# Altium project Doppler_Radar_Speed_Detector.PrjPcb
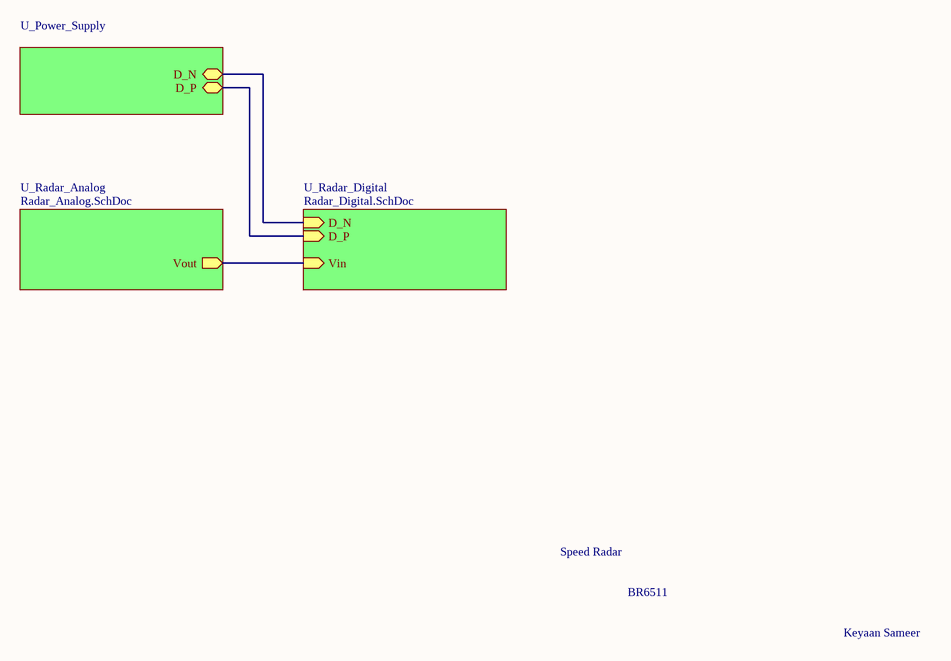
[diagram p0: SpeedRadarSchematic.SchDoc]
3 sheets, 31 parts. Net scope: hierarchical (ports join the sheet entries above them; power ports are global).
Board file: RADARPCB.PcbDoc
Sheets:
  SpeedRadarSchematic.SchDoc
    U_Radar_Digital = Radar_Digital.SchDoc
    U_Radar_Analog = Radar_Analog.SchDoc

## Sheet SpeedRadarSchematic.SchDoc
size A; SheetNumber: 1; SheetTotal: 4

### Sub-sheets
U_Power_Supply = Power_Supply.SchDoc (file not in this document): D_N (bidir), D_P (bidir)
U_Radar_Analog = Radar_Analog.SchDoc: Vout (out)
U_Radar_Digital = Radar_Digital.SchDoc: D_N (in), D_P (in), Vin (in)

### Nets
NetU1_13: sheet U_Radar_Digital/Vin, sheet U_Radar_Analog/Vout
NetU3_13: sheet U_Power_Supply/D_N, sheet U_Radar_Digital/D_N
NetU3_14: sheet U_Power_Supply/D_P, sheet U_Radar_Digital/D_P

### Notes on the sheet
- Speed Radar
- BR6511
- Keyaan Sameer

## Sheet Radar_Digital.SchDoc
size A; SheetNumber: 3; SheetTotal: 4
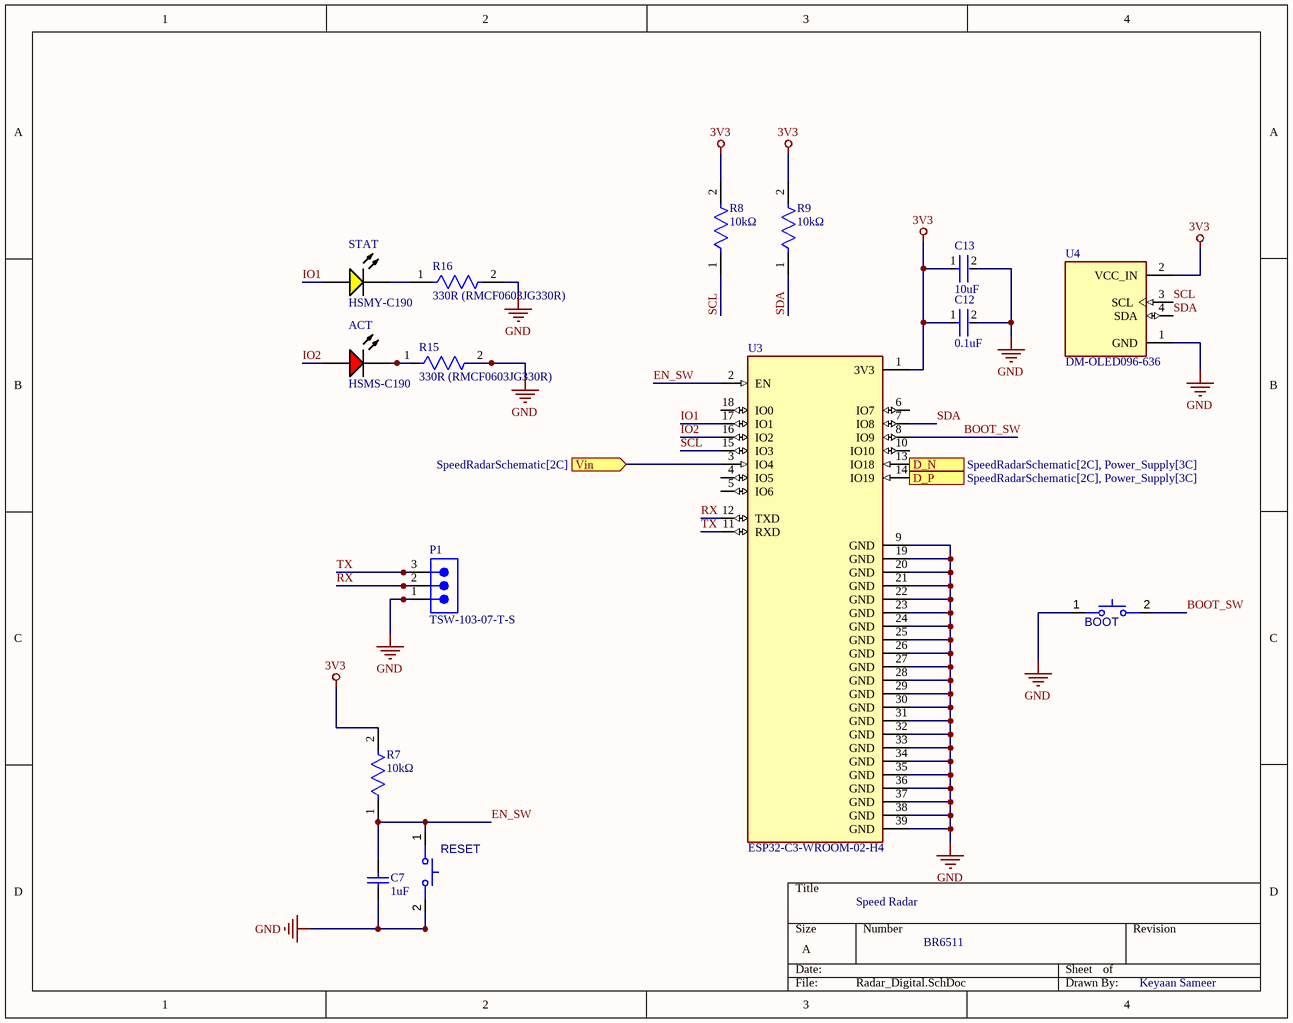
[diagram p1: Radar_Digital.SchDoc]

### Parts
ACT  HSMS-C190  [AVAG-HSMX-C190_V]
BOOT  B3U-1000P-B  [OMRON-B3U-1000P-2-B_V]  (value not drawn)
C7  1uF  [CAPC1608X90X35NL15T15]
C12  value 0.1uF  [FP-GCD21B-0_15-IPC_A]  (hidden comment: GCD21BR71H104KA01L)
C13  10uF  [FP-C0805C106K8RACAUTO-MFG]
P1  TSW-103-07-T-S  [SMTC-TSW-103-07-X-S]
R7  10kΩ  [FP-RQ732B-IPC_C]
R8  10kΩ  [FP-RQ732B-IPC_C]
R9  10kΩ  [FP-RQ732B-IPC_C]
R15  330R (RMCF0603JG330R)  [FP-RMCF0603-IPC_B]
R16  330R (RMCF0603JG330R)  [FP-RMCF0603-IPC_B]
RESET  B3U-1000P-B  [OMRON-B3U-1000P-2-B_V]  (value not drawn)
STAT  HSMY-C190  [AVAG-HSMX-C190_V]
U3  ESP32-C3-WROOM-02-H4  [MODULE_ESP32-C3-WROOM-02-H4]
U4  DM-OLED096-636  [MODULE_DM-OLED096-636]

### Ports
D_N (in, see SpeedRadarSchematic[2C], Power_Supply[3C]), D_P (in, see SpeedRadarSchematic[2C], Power_Supply[3C]), Vin (in, see SpeedRadarSchematic[2C])

### Nets
3V3: C12.1 C13.1 R7.2 R8.2 R9.2 U3.1(3V3) U4.2(VCC_IN)
GND: BOOT.1 C7.1 C12.2 C13.2 P1.1 R15.2 R16.2 RESET.2 U3.9(GND) U3.19(GND) U3.20(GND) U3.21(GND) U3.22(GND) U3.23(GND) U3.24(GND) U3.25(GND) U3.26(GND) U3.27(GND) U3.28(GND) U3.29(GND) U3.30(GND) U3.31(GND) U3.32(GND) U3.33(GND) U3.34(GND) U3.35(GND) U3.36(GND) U3.37(GND) U3.38(GND) U3.39(GND) U4.1(GND)
BOOT_SW: BOOT.2 U3.8(IO9)
EN_SW: C7.2 R7.1 RESET.1 U3.2(EN)
IO1: STAT.1(A) U3.17(IO1)
IO2: ACT.1(A) U3.16(IO2)
RX: P1.2 U3.12(TXD)
SCL: R8.1 U3.15(IO3) U4.3(SCL)
SDA: R9.1 U3.7(IO8) U4.4(SDA)
TX: P1.3 U3.11(RXD)
NetACT_2: ACT.2(K) R15.1
NetR16_1: R16.1 STAT.2(K)
NetU1_13: U3.3(IO4) ; port Vin
NetU3_13: U3.13(IO18) ; port D_N
NetU3_14: U3.14(IO19) ; port D_P

Not connected (* = marked no-connect by the designer): U3 4(IO5) 5(IO6) 6(IO7) 10(IO10) 18(IO0)

### Notes on the sheet
- Speed Radar
- BR6511
- Keyaan Sameer

### Library data of the parts
ACT = CMP-2000-06427-1: LED Uni-Color Red, 52 mW, 20 mA, -40 to 85 degC, 2-Pin SMD, RoHS, Tape and Reel; Manufacturer: Avago; Reverse Voltage: 5V; Viewing Angle: 170deg; High Brightness: No; Lens Type: ColorlessDiffused; DELETED: Compliant; Product Height (mm): 0.8mm; Dominant Wave Length: 626nm; Number of  Elements: 1; Chip Material: GaP; Lum Intensity: 10mcd; Product Length (mm): 1.6mm; Forward Voltage: 2.6V; Power Dissipation: 52W; Shape Type: Rectangular; Forward Current: 25mA; Peak Wavelength: 630nm; Test Current (It): 20mA; Main Category: ChipLED; Lens Dimensions: 1x0.8x0.5mm; Pin Count: 2; Package Reference: HSMX-C190; Mounting Technology: SurfaceMount; Mounting: SurfaceMount; Datasheet URL: http://docs.avagotech.com/docs/AV02-0551EN; Package Type: ChipLed; Operating Temperature Classification: Industrial; Datasheet Version: 03/2012; Operating Temp Range: -40Cto85C; Emitting Color: Red; Rad Hardened: No; Manufacturer URL: http://www.avagotech.com/; Luminous Intensity: 10mcd; Package Description: 2-Pin Surface Mount Device, Body 1.6 x 0.8 mm, Height 0.9 mm; Type: Uni-Color; Packaging: TapeandReel; Product Depth (mm): 0.8mm
BOOT RESET = CMP-011-00011-3: Ultra-small Surface-mounting Tactile Switches with High Contact Reliability, SPST-NO, -25 to 70 degC, 2-Pin SMD, RoHS, Tape and Reel; Voltage Rating: 12V; Current Rating: 50mA; Pins: 2; RoHS Compliant: Details
C7 = CMP-2006-04534-1: Part Number: 0603YD105MAT2A; Manufacturer: AVX Interconnect / Elco
C12 = CMP-001-00087-1: Ceramic Capacitor, Multilayer, Ceramic, 50V, 10% +Tol, 10% -Tol, X7R, 15% TC, 0.1uF, Surface Mount, 0805; Case/Package: 0805; Mounting Technology: Surface Mount; Min Operating Temperature: -55°C; Capacitor Type: Ceramic; Pins: 2; RoHS Compliant: Yes; Max Operating Temperature: 125°C
C13 = CMP-03020-034662-1: CAP CER 10UF 10V X7R 0805; Tolerance: 10%; Case/Package: 0805; Ratings: AEC-Q200; Packaging: Tape and Reel; Voltage Rating: 10V; Max Operating Temperature: 125°C; Min Operating Temperature: -55°C; Case Code (Metric): 2012; Case Code (Imperial): 0805; Mount: Surface Mount; RoHS Compliant: Yes; Capacitance: 10uF
P1 = CMP-1024-00332-1: 0.025" SQ Post Header, Through-hole, Vertical, -55 to 105 degC, 2.54 mm Pitch, 3-Pin, Male, RoHS; Manufacturer: Samtec; Pitch: 2.54 mm; ComponentLink1URL: http://www.samtec.com; ComponentLink3URL: http://www.samtec.com/documents/webfiles/cpdf/TSW-XXX-XX-XXX-X-XX-XXX-MKT.pdf; PartNumber: TSW-103-07-T-S; Mounting Technology: Through-hole; RoHS: True; DatasheetVersion: F-214; PackageVersion: DM, 8/1988; Temperature Range: -55 to 105 degC; ComponentLink2Description: Datasheet; ComponentLink1Description: Manufacturer URL; Orientation: Vertical; PackageReference: TSW-103-07-X-S; ComponentLink3Description: Package Specification; ComponentLink2URL: http://www.samtec.com/documents/webfiles/pdf/TSW_TH.PDF; PackageDescription: .025[0.64] SQ. Post Terminal Strip Assembly
R7-R9 = CMP-03211-005393-1: RQ732B 1206 10KΩ 0.4W 10ppm/°C 0.1% 200V; Manufacturer: TE; Manufacturer Part Number: RQ73C2B10KBTD; Automotive Grade: Grade 0; ComponentLink2URL: https://www.te.com/commerce/DocumentDelivery/DDEController?Action=showdoc&DocId=Data+Sheet%7F1773270-2%7FA%7Fpdf%7FEnglish%7FENG_DS_1773270-2_A.pdf%7F9-2176388-464; Temperature Range Low: -55°C; Power Rating: 0.4W; Voltage Rating: 200V; RoHS: TRUE; ComponentLink2Description: Datasheet; Composition: Thin Film; Temperature Coefficient: 10ppm/°C; Height: 0.75mm; Ipc Land Pattern Name: RESC310160X60; Series: RQ73; Temperature: -55°C to +155°C; Package: RQ732B; Automotive: Yes; Category: Res; Octopart: https://octopart.com/rq73c2b10kbtd-te+connectivity-93910771; Resistance: 10KΩ; Lead Free: Yes; Temperature Range High: +155°C; Device Class L3: Chip SMD Resistors; Tolerance: 0.1%; Device Class L1: Passive Components; Value: 10KΩ; Device Class L2: Resistors
R15 R16 = CMP-26527-007473-1: 330Ω ±5% 0.1W 0603 Thick Film Chip Resistor AEC-Q200 compliant; Max Power Dissipation: 100mW; Temperature Coefficient: 200ppm/°C; Case/Package: 0603; Length: 0.061inch; Tolerance: 5%; Series: RMCF; Width: 0.031inch; Radiation Hardening: No; Packaging: Tape and Reel; Min Operating Temperature: -55°C; RoHS Compliant: Yes; Mount: Surface Mount; Resistor Type: Thick Film; Features: Automotive AEC-Q200; Resistance: 330R; Contact Plating: Tin; Number of Terminations: 2; Max Operating Temperature: 155°C; Height: 0.022inch
STAT = CMP-1744-00003-1: LED Uni-Color Yellow, 65 mW, 20 mA, -40 to 85 degC, 2-Pin SMD, RoHS, Tape and Reel; Tolerance: 1%; Voltage Rating: 50 V; Power Rating: 100 mW; Case\Package: 0603; Resistance: 390 Ohm; Min Operating Temperature: -55 degC; Length: 1.6 mm; ComponentLink3Description: Package Specification; Mount: Surface Mount; PackageReference: HSMX-C190; ComponentLink2Description: Datasheet; DatasheetVersion: Mar-12; Case Code (Metric): 1608; Pins: 2; Package Quantity: 5000; ComponentLink2URL: http://docs.avagotech.com/docs/AV02-0551EN; ComponentLink1Description: Manufacturer URL; RoHSCompliant: true; Packaging: Tape and Reel; PackageDescription: 2-Pin Surface Mount Device, Body 1.6 x 0.8 mm, Height 0.9 mm; REACH SVHC: No SVHC; ComponentLink3URL: http://www.fairchildsemi.com/dwg/MA/MA03D.pdf; Voltage Rating (DC): 50 V; Width: 0.8 mm; ComponentLink1URL: http://www.avagotech.com/; Max Operating Temperature: 155 degC; Case Code (Imperial): 0603; Height: 0.45 mm
U3 = ESP32-C3-WROOM-02-H4: WiFi Modules (802.11) (Engineering Samples) SMD module, ESP32-C3, 4MB SPI flash, PCB antenna, -40 C +105 C; MF: Espressif Systems; SnapEDA_Link: https://www.snapeda.com/parts/ESP32-C3-WROOM-02-H4/Espressif+Systems/view-part/?ref=snap; Package: Package; Value: *; MP: ESP32-C3-WROOM-02-H4; Check_prices: https://www.snapeda.com/parts/ESP32-C3-WROOM-02-H4/Espressif+Systems/view-part/?ref=eda
U4 = DM-OLED096-636: 0.96â€ 128 X 64 MONOCHROME GRAPHIC OLED DISPLAY MODULE - I2C; SnapEDA_Link: https://www.snapeda.com/parts/DM-OLED096-636/Display+Module/view-part/?ref=snap; Package: Package; Value: *; MF: Display Module; MP: DM-OLED096-636; Check_prices: https://www.snapeda.com/parts/DM-OLED096-636/Display+Module/view-part/?ref=eda

## Sheet Radar_Analog.SchDoc
size A; SheetNumber: 2; SheetTotal: 4
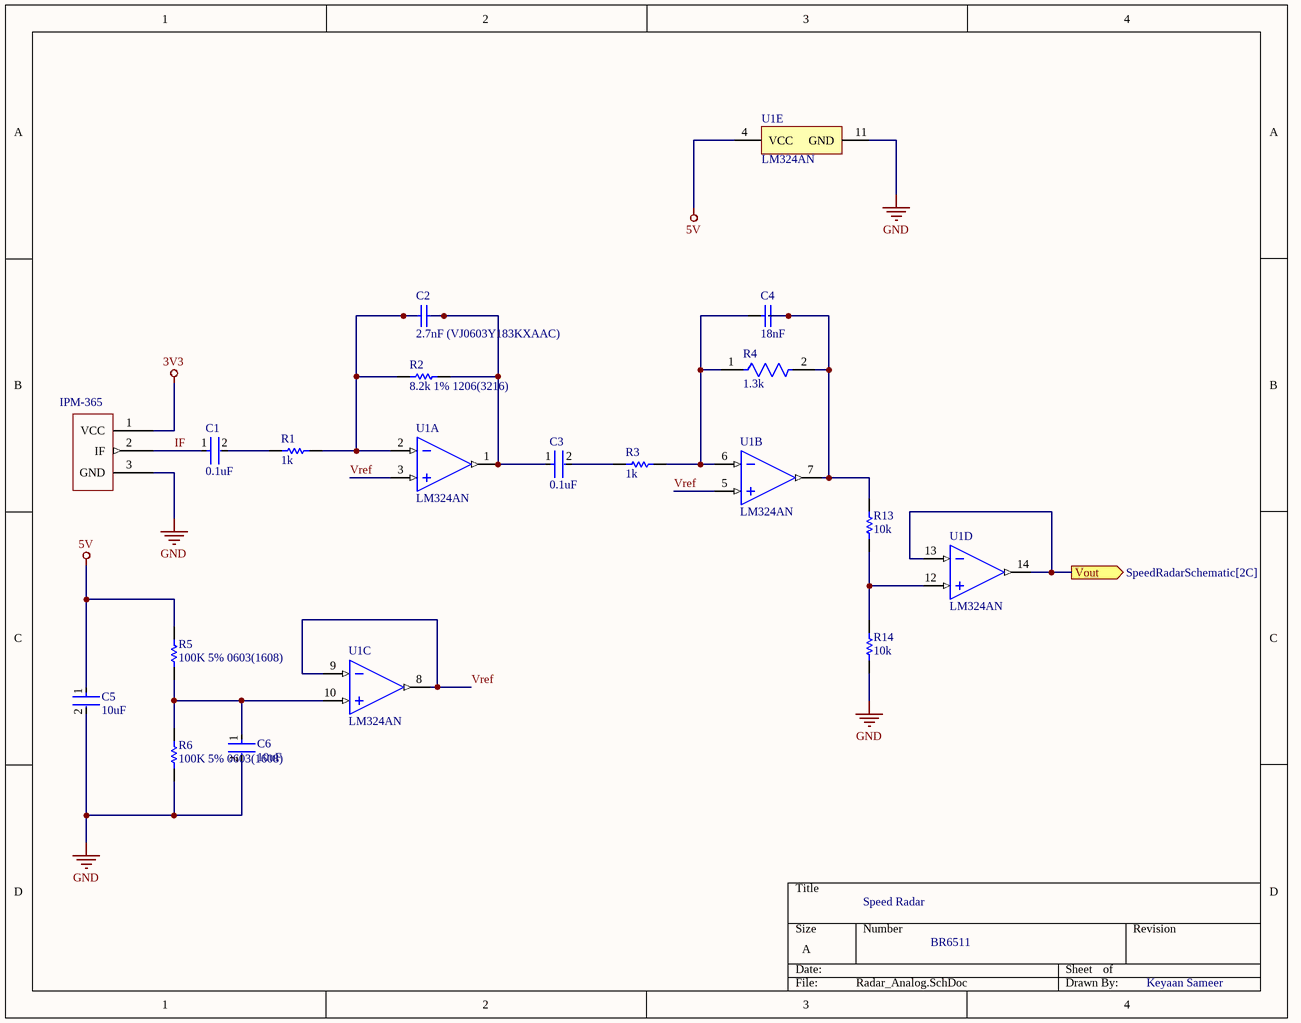
[diagram p2: Radar_Analog.SchDoc]

### Parts
C1  value 0.1uF  [FP-GCD21B-0_15-IPC_A]  (hidden comment: GCD21BR71H104KA01L)
C2  2.7nF (VJ0603Y183KXAAC)  [CAPC1608X92X38ML15T08]
C3  value 0.1uF  [FP-GCD21B-0_15-IPC_A]  (hidden comment: GCD21BR71H104KA01L)
C4  18nF  [CAPC1608X92X38ML15T08]
C5  10uF  [FP-C0805C106K8RACAUTO-MFG]
C6  10uF  [FP-C0805C106K8RACAUTO-MFG]
IPM-365  Component_1  [PCBComponent_1]  (value not drawn)
R1  value 1k  [RESC0805(2012)_L]  (hidden comment: Resistor 1K +/-5% 0805 125 mW)
R2  8.2k 1% 1206(3216)  [RESC1206(3216)_M]
R3  value 1k  [RESC0805(2012)_L]  (hidden comment: Resistor 1K +/-5% 0805 125 mW)
R4  1.3k  [FP-TFCR0603-IPC_B]
R5  100K 5% 0603(1608)  [RESC0603(1608)_N]
R6  100K 5% 0603(1608)  [RESC0603(1608)_N]
R13  value 10k  [RESC2013X50X35ML15T15]  (hidden comment: Resistor 10k +/-1% 0805 125 mW)
R14  value 10k  [RESC2013X50X35ML15T15]  (hidden comment: Resistor 10k +/-1% 0805 125 mW)
U1  LM324AN  [TI-N0014A]  (parts A,B,C,D,E of 5)

### Ports
Vout (out, see SpeedRadarSchematic[2C])

### Nets
3V3: IPM-365.1(VCC)
5V: C5.1 R5.2 U1.4(VCC)
GND: C5.2 C6.2 IPM-365.3(GND) R6.1 R14.1 U1.11(GND)
IF: C1.1 IPM-365.2(IF)
Vref: U1.3(1IN+) U1.5(2IN+) U1.8(3OUT) U1.9(3IN-)
NetC1_2: C1.2 R1.1
NetC2_1: C2.1 R1.2 R2.1 U1.2(1IN-)
NetC2_2: C2.2 C3.1 R2.2 U1.1(1OUT)
NetC3_2: C3.2 R3.1
NetC4_1: C4.1 R3.2 R4.1 U1.6(2IN-)
NetC4_2: C4.2 R4.2 R13.2 U1.7(2OUT)
NetC6_1: C6.1 R5.1 R6.2 U1.10(3IN+)
NetR13_1: R13.1 R14.2 U1.12(4IN+)
NetU1_13: U1.13(4IN-) U1.14(4OUT) ; port Vout

### Notes on the sheet
- Speed Radar
- BR6511
- Keyaan Sameer

### Library data of the parts
C1 C3 = CMP-001-00087-1: as C12 on sheet Radar_Digital; Case/Package: 0805; Mounting Technology: Surface Mount; Min Operating Temperature: -55°C; Capacitor Type: Ceramic; Pins: 2; RoHS Compliant: Yes; Max Operating Temperature: 125°C
  C3: ComponentLink1Description: New link; ComponentLink1URL: *; ComponentLink2Description: New link 1; ComponentLink2URL: *; Parameter 1: *
C2 = CMP-2006-01326-1: Manufacturer: Vitramon; Part Number: VJ0603Y183KXAAC
C4 = CMP-1035-02398-2: Manufacturer: Vitramon; Part Number: VJ0603Y183JXXAC
C5 C6 = CMP-03020-034662-1: as C13 on sheet Radar_Digital; Case/Package: 0805; Ratings: AEC-Q200; Packaging: Tape and Reel; Voltage Rating: 10V; Max Operating Temperature: 125°C; Min Operating Temperature: -55°C; Case Code (Metric): 2012; Case Code (Imperial): 0805; Mount: Surface Mount; RoHS Compliant: Yes; Capacitance: 10uF
R1 R3 = CMP-009-00118-4: Chip Resistor, 1 kOhms, +/-5%, 125 mW, -55 to 155 degC, 0805; Tolerance: 5%; Power: 125mW; Max Operating Temperature: 155°C; Case/Package: 0805; Min Operating Temperature: -55°C; Pins: 2
R2 = CMP-1014-00613-1: 8K2 0.25W 1% 1206 (3216 Metric)  SMD; Case-EIA: 1206; Value: 8200.00 Ohm; Case-Metric: 3216; Tolerance: 1 %; Technology: SMT; Power: 0.25 W
R4 = CMP-250906-279364-1: RES Thin Film,  1.3kΩ, 0.1%, 0.1W, 25ppm/°C, 0603
R5 R6 = CMP-1012-00122-1: 100K 0.1W 5% 0603 (1608 Metric)  SMD; Case-EIA: 0603; Value: 100000.00 Ohm; Case-Metric: 1608; Tolerance: 5 %; Power: 0.1 W; Technology: SMT
R13 R14 = CMP-009-00018-6: Chip Resistor, 10 KOhm, +/- 1%, 125 mW, -55 to 155 degC, 0805 (2012 Metric); Voltage Rating: 150V; Power: 125mW; Pins: 2; Case/Package: 0805; Mounting Technology: SM; RoHS Compliant: True; Min Operating Temperature: -55°C; Max Operating Temperature: 155°C; Tolerance: 1%
U1 = CMP-014-00016-2: Quadruple Operational Amplifier, 1.2 MHz, 0 to 70 degC, 14-Pin PDIP (N), Pb-Free (RoHS), Tube; Manufacturer: Texas Instruments (TI); Max Dual Supply Voltage: 16V; Nominal Dual Supply Voltage: 12V; Nominal Voltage Gain: 100dB; Min Supply Voltage: 1.5V; Unity Gain Bandwidth Product: 1.2MHz; Output Current: 30mA; Nominal Supply Current: 3mA; RoHS Compliant: True; Package Reference: N-14; Min Operating Temperature: 0°C; Case/Package: DIP; Mounting Technology: TH; Package Description: 14-Pin Double In-line Package, Body 19.305 x 6.35 mm, Pitch 2.54 mm; Nominal Supply Voltage: 12V; Package URL: http://www.ti.com/lit/ml/mpdi002c/mpdi002c.pdf; Package Quantity: 25; Datasheet Version: SLOS066W, 03/2015; Manufacturer URL: http://www.ti.com/; Datasheet URL: http://www.ti.com/lit/ds/symlink/lm324a.pdf; Min Dual Supply Voltage: 1.5V; Max Supply Voltage: 16V; Pins: 14; Max Operating Temperature: 70°C

## Nets that join several sheets
3V3: Radar_Digital (7 pins), Radar_Analog (IPM-365.1)
GND: Radar_Digital (31 pins), Radar_Analog (6 pins)
NetU1_13: Radar_Digital (U3.3), Radar_Analog (U1.13 U1.14)